# Altium schematic sheet Sheet1.SchDoc
size A
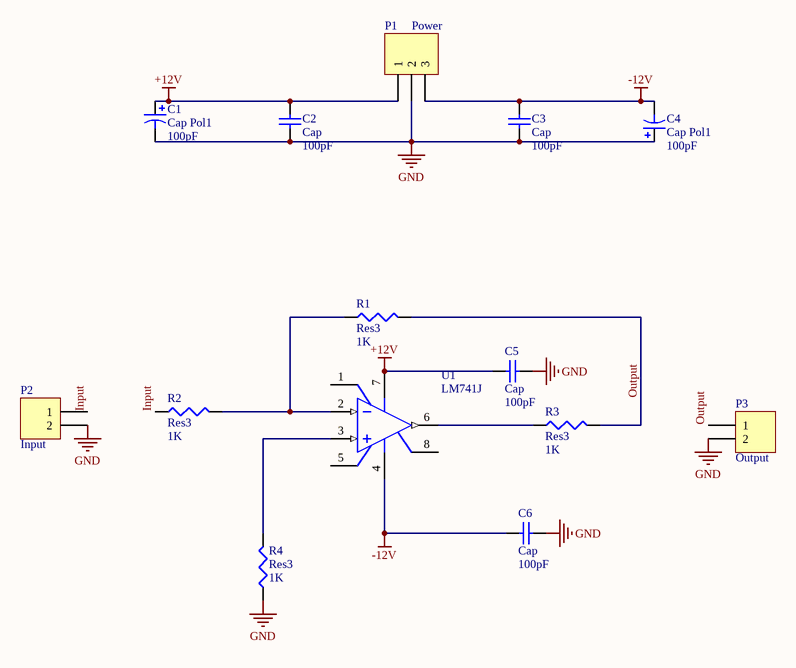
[diagram p0: Sheet1.SchDoc]

## Parts
C1  Cap Pol1  value 100pF  [CAPR5-4X5]
C2  Cap  value 100pF  [CAPR5-4X5]
C3  Cap  value 100pF  [CAPR5-4X5]
C4  Cap Pol1  value 100pF  [CAPR5-4X5]
C5  Cap  value 100pF  [CAPR5-4X5]
C6  Cap  value 100pF  [CAPR5-4X5]
P1  Power  [HDR1X3]
P2  Input  [HDR1X2H]
P3  Output  [HDR1X2]
R1  Res3  value 1K  [J1-0603]
R2  Res3  value 1K  [J1-0603]
R3  Res3  value 1K  [J1-0603]
R4  Res3  value 1K  [J1-0603]
U1  LM741J  [J08A]

## Nets
+12V: C1.1 C2.2 C5.1 P1.1 U1.7(V+)
-12V: C3.2 C4.2 C6.1 P1.3 U1.4(V-)
GND: C1.2 C2.1 C3.1 C4.1 C5.2 C6.2 P1.2 P2.2 P3.2 R4.1
Input: P2.1 R2.1
Output: P3.1 R1.2 R3.2
NetR1_1: R1.1 R2.2 U1.2(IN-)
NetR3_1: R3.1 U1.6(OUT)
NetR4_2: R4.2 U1.3(IN+)

Not connected (* = marked no-connect by the designer): U1 1(OFS_NULL) 5(OFS_NULL) 8(NC)

## Library data of the parts
C1 C4 = Cap Pol1: Polarized Capacitor (Radial); Published: 8-Jun-2000; LatestRevisionDate: 17-Jul-2002; LatestRevisionNote: Re-released for DXP Platform.; PackageReference: RB7.6-15; Publisher: Altium Limited; PackageDescription: Polarized Capacitor (Radial); 2 Leads
C2 C3 C5 C6 = Cap: Capacitor; Published: 8-Jun-2000; LatestRevisionDate: 17-Jul-2002; LatestRevisionNote: Re-released for DXP Platform.; PackageReference: RAD-0.3; Publisher: Altium Limited; PackageDescription: Radial Cap, Thru-Hole; 2 Leads; 0.3 in Pin Spacing
P1 = Header 3: Header, 3-Pin; LatestRevisionDate: 17-Jul-2002; LatestRevisionNote: Re-released for DXP Platform.; Publisher: Altium Limited
P2 = Header 2H: Header, 2-Pin, Right Angle; LatestRevisionDate: 17-Jul-2002; LatestRevisionNote: Re-released for DXP Platform.; Publisher: Altium Limited
P3 = Header 2: Header, 2-Pin; LatestRevisionDate: 17-Jul-2002; LatestRevisionNote: Re-released for DXP Platform.; Publisher: Altium Limited
R1-R4 = Res3: Resistor; Published: 8-Jun-2000; LatestRevisionDate: 29-May-2009; LatestRevisionNote: IPC-7351 Footprint Added.; PackageReference: J1-0603; Publisher: Altium Limited; PackageDescription: Chip Resistor
U1 = LM741J: Operational Amplifier, 8-pin CerDIP; Manufacturer: National Semiconductor; PackageTopMarking: NSUZXYTT*LM741J; PowerWise: N; CompType: Amplifiers; High-Reliability: Y; DatasheetVersion: Aug-2000; PackageVersion: revM, Jul-2002; PackageReference: J08A; PackageDescription: Cerdip, .400 x .310in Body, 8 Lead, .300in Centers, .100in Pitch; PartNumber: LM741J; RoHS: N; PinCount: 8; ComponentLink1Description: Manufacturer URL; ComponentLink1URL: http://www.national.com/; ComponentLink2Description: LM741 Datasheet; ComponentLink2URL: http://www.national.com/ds/LM/LM741.pdf; ComponentLink3Description: LM741 Web Page; ComponentLink3URL: http://www.national.com/pf/LM/LM741.html; ComponentLink4Description: J08A Package Page; ComponentLink4URL: http://www.national.com/packaging/folders/j08a.html